# EAGLE design Octal_Reactor_Core_v0 (EAGLE 8.7.1)
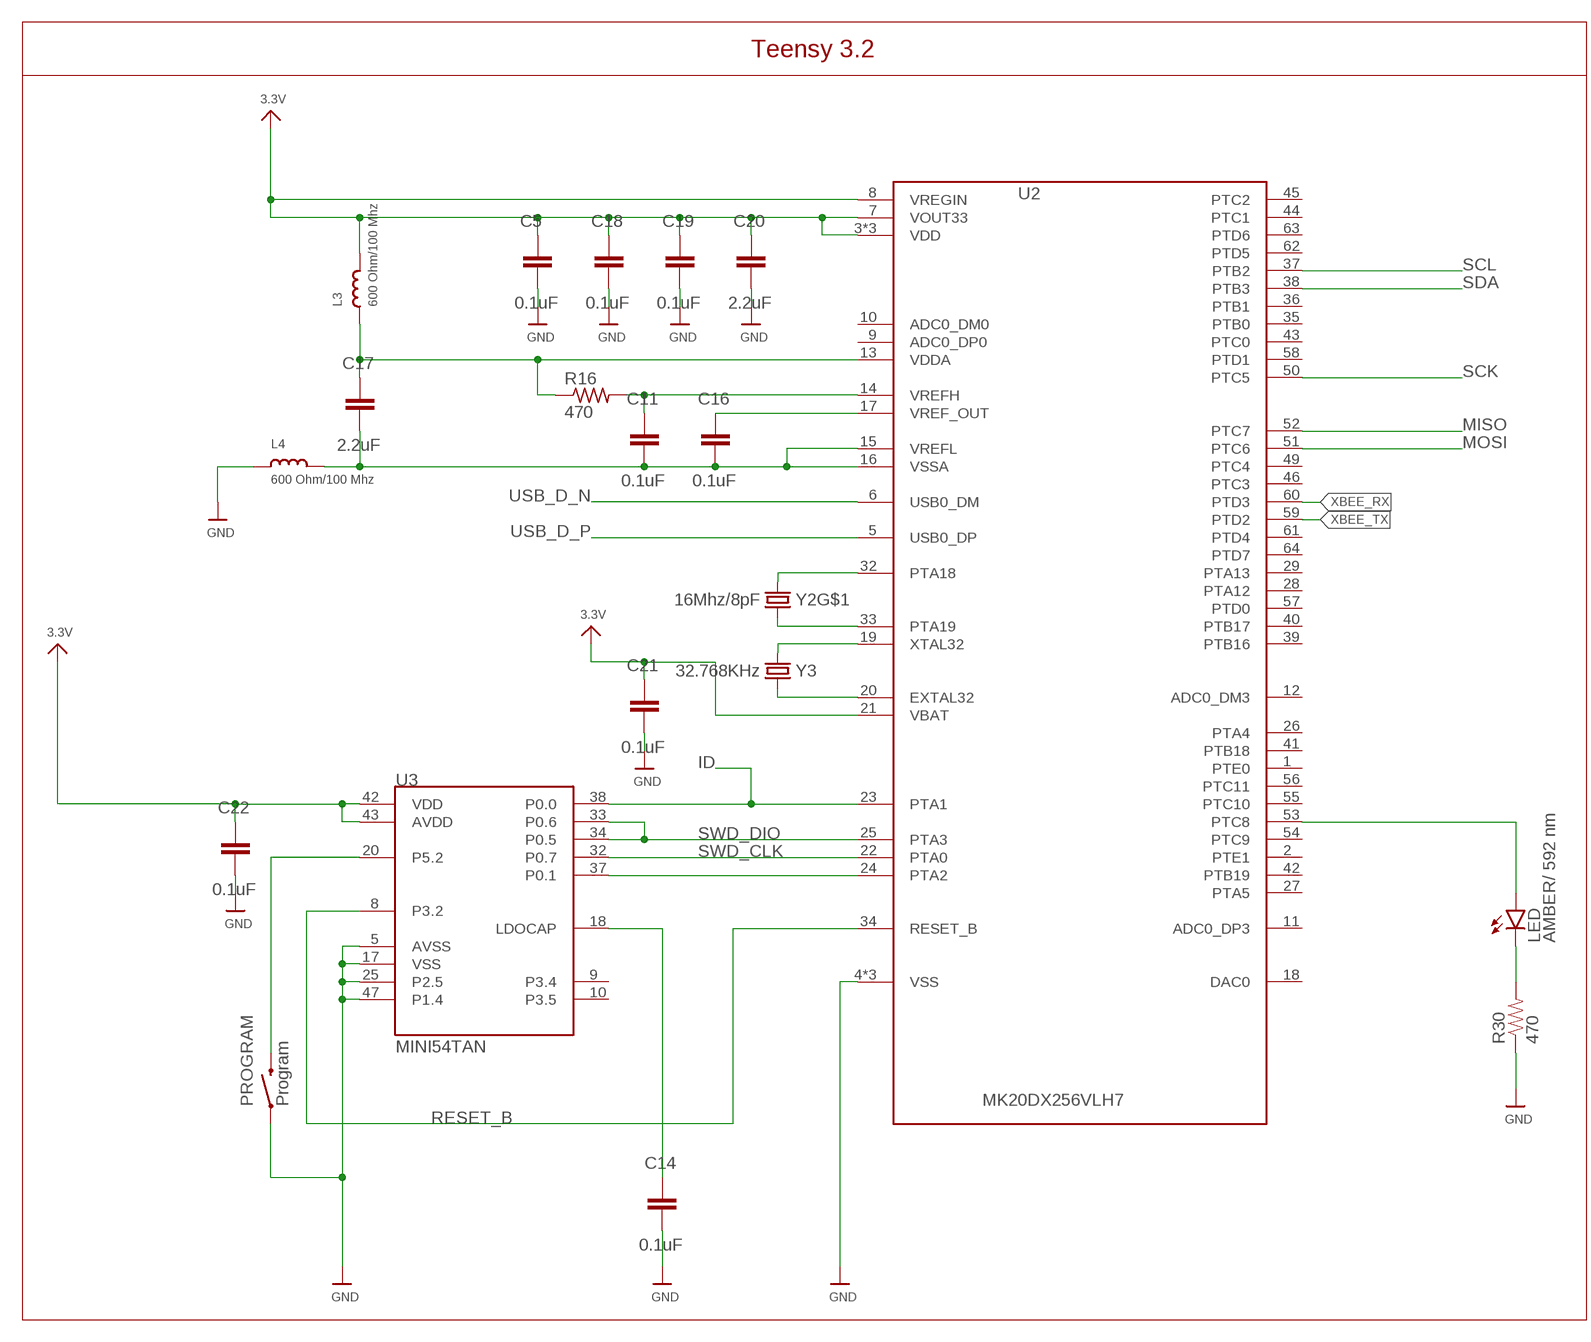
[diagram p0: schematic, sheet 1, part 1 of 2]
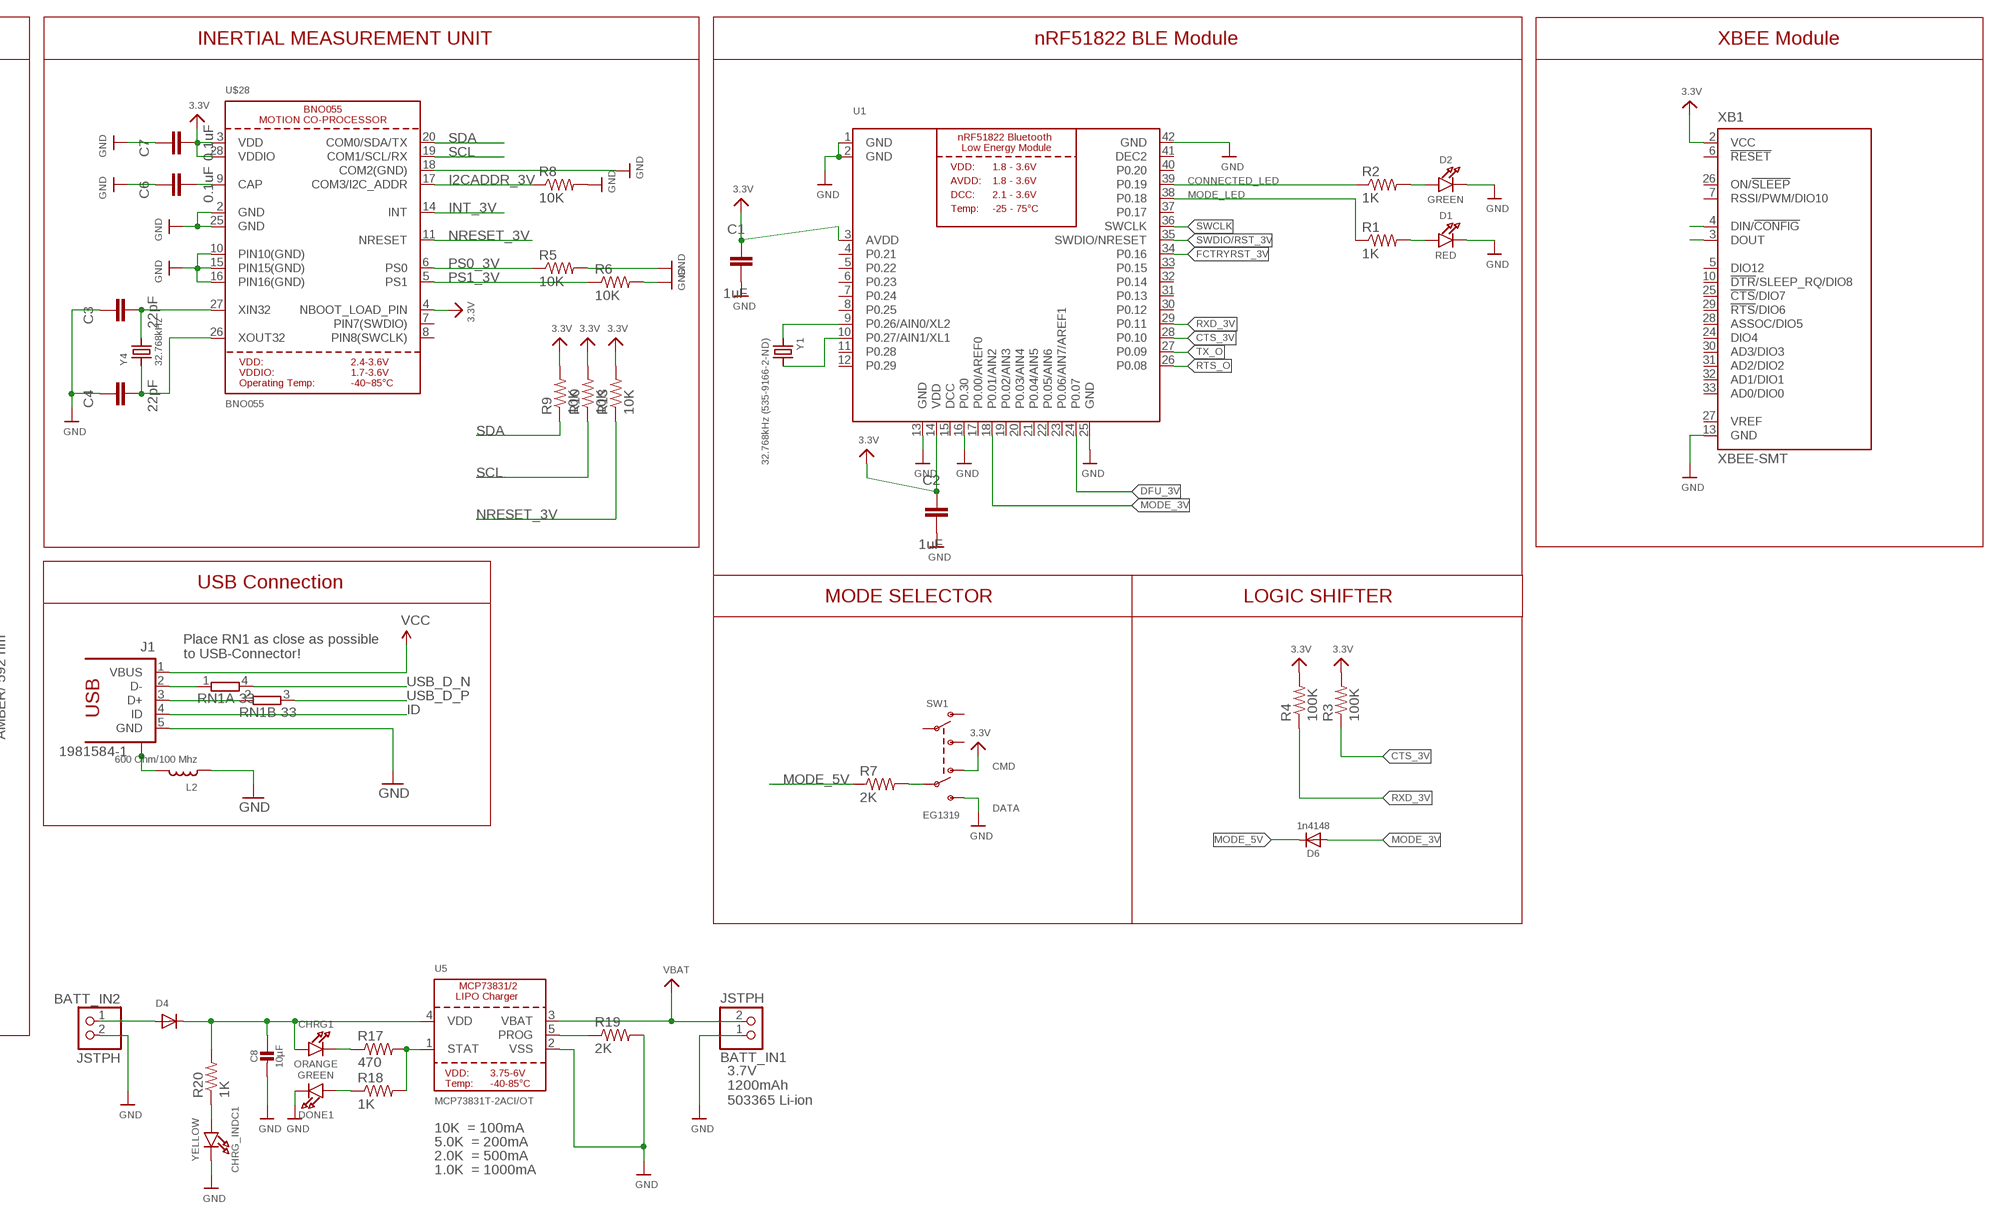
[diagram p1: schematic, sheet 1, part 2 of 2]

## Parts
BATT_IN1  JSTPH  JST_2PIN  [JSTPH2]
BATT_IN2  JSTPH  JST_2PIN  [JSTPH2]
C1  1uF  CC0402JRNPO9BN100  [CAP_0402]
C2  1uF  CC0402JRNPO9BN100  [CAP_0402]
C3  22pF  CC0402JRNPO9BN100  [CAP_0402]
C4  22pF  CC0402JRNPO9BN100  [CAP_0402]
C5  0.1uF  CC0402JRNPO9BN100  [CAP_0402]
C6  0.1uF  CC0402JRNPO9BN100  [CAP_0402]
C7  0.1uF  CC0402JRNPO9BN100  [CAP_0402]
C8  10µF  CAP_CERAMIC0805-NOOUTLINE  [0805-NO]
C11  0.1uF  CC0402JRNPO9BN100  [CAP_0402]
C14  0.1uF  CC0402JRNPO9BN100  [CAP_0402]
C16  0.1uF  CC0402JRNPO9BN100  [CAP_0402]
C17  2.2uF  CC0402JRNPO9BN100  [CAP_0402]
C18  0.1uF  CC0402JRNPO9BN100  [CAP_0402]
C19  0.1uF  CC0402JRNPO9BN100  [CAP_0402]
C20  2.2uF  CC0402JRNPO9BN220  [CAP_0402]
C21  0.1uF  CC0402JRNPO9BN100  [CAP_0402]
C22  0.1uF  CC0402JRNPO9BN100  [CAP_0402]
CHRG1  ORANGE  LED0805_NOOUTLINE  [CHIPLED_0805_NOOUTLINE]
CHRG_INDC1  YELLOW  LED0805_NOOUTLINE  [CHIPLED_0805_NOOUTLINE]
D1  RED  LED0805_NOOUTLINE  [CHIPLED_0805_NOOUTLINE]
D2  GREEN  LED0805_NOOUTLINE  [CHIPLED_0805_NOOUTLINE]
D4  DIODESOD-123  [SOD-123]
D6  1n4148  DIODESOD-323  [SOD-323]
DONE1  GREEN  LED0805_NOOUTLINE  [CHIPLED_0805_NOOUTLINE]
J1  1981584-1  [1981584-1]
L2  600 Ohm/100 Mhz  INDUCTOR-BK2125HM601-T  [0805]
L3  600 Ohm/100 Mhz  INDUCTOR-BK2125HM601-T  [0805]
L4  600 Ohm/100 Mhz  INDUCTOR-BK2125HM601-T  [0805]
LED  AMBER/ 592 nm  LED-AMBER  [LED-0603]
PROGRAM  Program  SWITCH-MOMENTARY-2-SMD-1101NE  [TACTILE-SWITCH-1101NE]
R1  1K  RC0402JR-070RL  [RES_0402]
R2  1K  RC0402JR-070RL  [RES_0402]
R3  100K  RC0402JR-070RL  [RES_0402]
R4  100K  RC0402JR-070RL  [RES_0402]
R5  10K  RC0402JR-070RL  [RES_0402]
R6  10K  RC0402JR-070RL  [RES_0402]
R7  2K  RC0402JR-070RL  [RES_0402]
R8  10K  RC0402JR-070RL  [RES_0402]
R9  10K  RC0402JR-070RL  [RES_0402]
R10  10K  RC0402JR-070RL  [RES_0402]
R13  10K  RC0402JR-070RL  [RES_0402]
R16  470  RC0402JR-070RL  [RES_0402]
R17  470  RC0402JR-070RL  [RES_0402]
R18  1K  RC0402JR-070RL  [RES_0402]
R19  2K  RC0402JR-070RL  [RES_0402]
R20  1K  RC0402JR-070RL  [RES_0402]
R30  470  RESISTOR-470  [0603-RES]
RN1  33  2R-NEXB34V  [EXB34V]
SW1  EG1319  SWITCH_DPDTEG1390  [EG1390]
U1  NRF51822_MODULE_MDBT40  [BLE_MODULE_RAYTAC_MDBT40]
U2  MK20DX256VLH7  [MK20DX256VLH7]
U3  MINI54TAN  [MINI54TAN]
U5  MCP73831T-2ACI/OT  MCP73831/2  [SOT23-5]
U$28  BNO055  [BNO055]
XB1  XBEE-SMT  [XBEE-SMT]
Y1  32.768kHz (535-9166-2-ND)  CRYSTAL2.0X6.0_32.768  [CRYSTAL_CYL_2X6MM_SMT]
Y2  16Mhz/8pF  CRYSTAL/SMD-5X3-GND16MHZ/8PF  [CRYSTAL-SMD-5X3]
Y3  32.768KHz  CRYSTAL/32.768KHZ/SMD-TXC_7A  [CRYSTAL-TXC-7A]
Y4  32.768kHz  CRYSTAL8.0X3.8  [CRYSTAL_8X3.8]

## Nets
3.3V: C1.1 C2.1 C5.1 C7.2 C18.1 C19.1 C20.1 C21.1 C22.1 L3.2 R3.2 R4.2 R9.2 R10.2 R13.2 SW1.O2 U1.3(AVDD) U1.14(VDD) U2.3(VDD) U2.7(VOUT33) U2.8(VREGIN) U2.21(VBAT) U2.30(VDD) U2.48(VDD) U3.42(VDD) U3.43(AVDD) U$28.3(VDD) U$28.4(NBOOT_LOAD_PIN) U$28.28(VDDIO) XB1.2(VCC)
CONNECTED_LED: R2.1 U1.39(P0.19)
CTS_3V: R3.1 U1.28(P0.10)
DFU_3V: U1.24(P0.07)
FCTRYRST_3V: U1.34(P0.16)
GND: BATT_IN1.1 BATT_IN2.2 C1.2 C2.2 C3.1 C4.1 C5.2 C6.1 C7.1 C8.2 C14.2 C18.2 C19.2 C20.2 C21.2 C22.2 CHRG_INDC1.C D1.C D2.C DONE1.C J1.5(GND) L2.1 L4.1 PROGRAM.P$1 R5.2 R6.2 R8.2 R19.2 R30.1 SW1.S2 U1.1(GND) U1.2(GND) U1.13(GND) U1.16(P0.30) U1.25(GND) U1.42(GND) U2.4(VSS) U2.31(VSS) U2.47(VSS) U3.5(AVSS) U3.17(VSS) U3.25(P2.5) U3.47(P1.4) U5.2(VSS) U$28.2(GND) U$28.10(PIN10(GND)) U$28.15(PIN15(GND)) U$28.16(PIN16(GND)) U$28.18(COM2(GND)) U$28.25(GND) XB1.13(GND)
I2CADDR_3V: R8.1 U$28.17(COM3/I2C_ADDR)
ID: J1.4(ID) U2.23(PTA1) U3.38(P0.0)
INT_3V: U$28.14(INT)
MISO: U2.52(PTC7)
MODE_3V: D6.A U1.18(P0.01/AIN2)
MODE_5V: D6.C R7.1
MODE_LED: R1.1 U1.38(P0.18)
MOSI: U2.51(PTC6)
N$1: U1.9(P0.26/AIN0/XL2) Y1.1
N$2: U1.10(P0.27/AIN1/XL1) Y1.2
N$3: C3.2 U$28.27(XIN32) Y4.P$4
N$4: R7.2 SW1.P2
N$5: D1.A R1.2
N$6: D2.A R2.2
N$7: XB1.4(DIN/!CONFIG)
N$8: XB1.3(DOUT)
N$9: C4.2 U$28.26(XOUT32) Y4.P$1
N$10: C6.2 U$28.9(CAP)
N$12: LED.A U2.53(PTC8)
N$15: U2.24(PTA2) U3.37(P0.1)
N$16: CHRG1.C R17.1
N$18: LED.C R30.2
N$19: PROGRAM.P$2 U3.20(P5.2)
N$22: C14.1 U3.18(LDOCAP)
N$25: R17.2 R18.2 U5.1(STAT)
N$26: R19.1 U5.5(PROG)
N$27: U2.32(PTA18) Y2.3
N$28: U2.33(PTA19) Y2.1
N$29: U2.19(XTAL32) Y3.P$2
N$30: U2.20(EXTAL32) Y3.P$1
N$31: DONE1.A R18.1
N$33: C8.1 CHRG1.A D4.C R20.2 U5.4(VDD)
N$35: CHRG_INDC1.A R20.1
NRESET_3V: R13.1 U$28.11(NRESET)
PS0_3V: R5.1 U$28.6(PS0)
PS1_3V: R6.1 U$28.5(PS1)
RESET_B: U2.34(RESET_B) U3.8(P3.2)
RTS_O: U1.26(P0.08)
RXD_3V: R4.1 U1.29(P0.11)
SCK: U2.50(PTC5)
SCL: R10.1 U2.37(PTB2) U$28.19(COM1/SCL/RX)
SDA: R9.1 U2.38(PTB3) U$28.20(COM0/SDA/TX)
SWCLK: U1.36(SWCLK)
SWD_CLK: U2.22(PTA0) U3.32(P0.7)
SWD_DIO: U2.25(PTA3) U3.33(P0.6) U3.34(P0.5)
SWDIO/RST_3V: U1.35(SWDIO/NRESET)
TX_O: U1.27(P0.09)
USB_CON_N [USB]: J1.2(D-) RN1.1
USB_CON_P [USB]: J1.3(D+) RN1.2
USB_D_N [USB]: RN1.4 U2.6(USB0_DM)
USB_D_P [USB]: RN1.3 U2.5(USB0_DP)
USB_SHIELD: J1.S1 J1.S2 J1.S3 J1.S4 L2.2
VBAT: BATT_IN1.2 U5.3(VBAT)
VCC: J1.1(VBUS)
VDDA: C17.1 L3.1 R16.1 U2.13(VDDA)
VREF_OUT: C16.1 U2.17(VREF_OUT)
VREFH: C11.1 R16.2 U2.14(VREFH)
VREFL: C11.2 C16.2 C17.2 L4.2 U2.15(VREFL) U2.16(VSSA)
VUSB: BATT_IN2.1 D4.A
XBEE_RX: U2.60(PTD3)
XBEE_TX: U2.59(PTD2)
Unconnected: SW1.O1 SW1.P1 SW1.S1 U1.4(P0.21) U1.5(P0.22) U1.6(P0.23) U1.7(P0.24) U1.8(P0.25) U1.11(P0.28) U1.12(P0.29) U1.17(P0.00/AREF0) U1.19(P0.02/AIN3) U1.20(P0.03/AIN4) U1.21(P0.04/AIN5) U1.22(P0.05/AIN6) U1.23(P0.06/AIN7/AREF1) U1.30(P0.12) U1.31(P0.13) U1.32(P0.14) U1.33(P0.15) U1.37(P0.17) U1.40(P0.20) U2.1(PTE0) U2.2(PTE1) U2.9(ADC0_DP0) U2.10(ADC0_DM0) U2.11(ADC0_DP3) U2.12(ADC0_DM3) U2.18(DAC0) U2.26(PTA4) U2.27(PTA5) U2.28(PTA12) U2.29(PTA13) U2.35(PTB0) U2.36(PTB1) U2.39(PTB16) U2.40(PTB17) U2.41(PTB18) U2.42(PTB19) U2.43(PTC0) U2.44(PTC1) U2.45(PTC2) U2.46(PTC3) U2.49(PTC4) U2.54(PTC9) U2.55(PTC10) U2.56(PTC11) U2.57(PTD0) U2.58(PTD1) U2.61(PTD4) U2.62(PTD5) U2.63(PTD6) U2.64(PTD7) U3.9(P3.4) U3.10(P3.5) U$28.7(PIN7(SWDIO)) U$28.8(PIN8(SWCLK)) XB1.5(DIO12) XB1.6(!RESET) XB1.7(RSSI/PWM/DIO10) XB1.10(!DTR!/SLEEP_RQ/DIO8) XB1.24(DIO4) XB1.25(!CTS!/DIO7) XB1.26(ON/!SLEEP) XB1.27(VREF) XB1.28(ASSOC/DIO5) XB1.29(!RTS!/DIO6) XB1.30(AD3/DIO3) XB1.31(AD2/DIO2) XB1.32(AD1/DIO1) XB1.33(AD0/DIO0) Y2.2(GND:GND) Y2.4(GND:GND)

## Notes on the sheet
- Teensy 3.2 | INERTIAL MEASUREMENT UNIT | nRF51822 BLE Module | XBEE Module
- USB Connection
- MODE SELECTOR | LOGIC SHIFTER
- Place RN1 as close as possible
  to USB-Connector!
- CMD
- DATA
- 3.7V
  1200mAh
  503365 Li-ion
- 10K  = 100mA
- 5.0K  = 200mA
- 2.0K  = 500mA
- 1.0K  = 1000mA

## Power pins joined to a net without a drawn wire
DCC: U1.15(DCC)
DEC2: U1.41(DEC2)

## Library data of the parts
BATT_IN1 BATT_IN2 = microbuilder:JST_2PIN: JST 2-Pin Right-Angle Connector PH-Series - 4UConnector: 17311 SH-Series - 4UConnector: 07278
C1-C7 C11 C14 C16-C19 C21 C22 = Resistor_Capacitor:CC0402JRNPO9BN100: CAP CER 10PF 50V C0G/NPO 0402 Manufacturer's datasheet <http://www.yageo.com/documents/recent/UPY-GP_NP0_16V-to-50V_16.pdf>; CREATED_BY: PCBLayout.com; DIGIKEY_PART_NUMBER: 311-1014-2-ND; MANUFACTURER: Yageo; MPN: CC0402JRNPO9BN100; PACKAGE: SMD 0402
C8 = microbuilder:CAP_CERAMIC: Ceramic Capacitors For new designs, use the packages preceded by an '_' character since they are more reliable: The following footprints should be used on most boards: _0402 - Standard footprint for regular board layouts _0603 - Standard footprint for regular board layouts _0805 - Standard footprint for regular board layouts _1206 - Standard footprint for regular board layouts For extremely tight-pitch boards where space is at a premium, the following 'micro-pitch' footprints can be used (smaller pads, no silkscreen outline, etc.): _0402MP - Micro-pitch footprint for very dense/compact boards _0603MP - Micro-pitch footprint for very dense/compact boards _0805MP - Micro-pitch footprint for very dense/compact boards _1206MP - Micro-pitch footprint for very dense/compact boards
C20 = Resistor_Capacitor:CC0402JRNPO9BN220: CAP CER 22PF 50V C0G/NPO 0402 Manufacturer's datasheet <http://www.yageo.com/documents/recent/UPY-GP_NP0_16V-to-50V_16.pdf>; CREATED_BY: PCBLayout.com; DIGIKEY_PART_NUMBER: 311-1018-2-ND; MANUFACTURER: Yageo; MPN: CC0402JRNPO9BN220; PACKAGE: SMD 0402
CHRG1 CHRG_INDC1 D1 D2 DONE1 = microbuilder:LED: LED 0603 - 0603 Surface Mount Package 2mA: Green LED - Low Power (3.9mcd, 2ma, 1.7Vf) - Digikey: 475-2709-2-ND Orange LED - Low Power (9.8mcd, 2ma, 1.8Vf) - Digikey: 475-1194-2-ND Red LED - Low Power (5mcd, 2ma, 1.8Vf) - Digikey: 475-1195-2-ND Yellow LED - Low Power (7mcd, 2ma, 1.8Vf) - Digikey: 475-1196-2-ND 5mA: Blue LED - Low Power (17mcd, 5ma, 2.9Vf) - Digikey: LNJ937W8CRACT-ND 0805 - 0805 Surface Mount Package 2mA: Red LED (8.8mcd, 2mA, 1.8Vf, Clear) - Low Power [Digikey: 475-2510-1-ND] Green LED (5mcd, 2mA, 1.8Vf, Clear) - Low Power [Digikey: 475-2730-1-ND] Yellow LED (11.3mcd, 2mA, 1.8Vf, Clear) - Low Power [Digikey: 475-2555-1-ND] 20mA: Red LED (104mcd, 20mA, Diffused) - LS R976 [Digikey: 475-1278-6-ND] Red LED (12mcd, 20mA, 2.0Vf, Clear) - APT2012EC [Digikey: 754-1128-1-ND] Green LED (15mcd, 20mA, 2.2Vf, Clear) - APT2012GC [Digikey: 754-1131-1-ND] Orange LED (160mcd, 20mA, 2.1Vf, Clear) - APT2012SECK [Digikey: 754-1130-1-ND] 1206 - 1206 Surface Mount Package Green LED (26mcd, 20mA, Diffused) - LG N971 [Digikey: 475-1407-6-ND] Red LED (15mcd, 20mA, Diffused) - LH N974 [Digikey: 475-1416-6-ND] Cree - Cree High-Power Surface Mount LEDs XPEBWT-L1-0000-00D50 - White 111lm 350mA 2.9Vf 6200K 110° XTEAWT-00-0000-00000LEE3 - White 114lm 350mA 2.85Vf 5000K 115° Everlight - Everlight 45-21 Series Surface Mount LEDs 45-21/QK2C-B2832AC2CB2/2T - Warm White 2000mcd 20mA 3.25Vf 3050K 120° 45-21/LK2C-B38452C4CB2/2T - Nuetral White 2000mcd 20mA 3.25Vf 4150K 120° 45-21/LK2C-B50634C6CB2/2T - Cold White 2200mcd 20mA 3.25Vf 5650K 120° PLCC2 Reverse Mount LS T77K-J1L2-1-0-2-R18-Z - Red 11.25mcd 2mA 1.8Vf 630nm 120° LO T77K-L1M2-24-Z - Orange 19.6mcd 2mA 1.8Vf 606nm 120° LY T77K-K2M1-26-Z - Yellow 15.7mcd 2mA 1.8Vf 587nm 120°
D4 = adafruit:DIODE: Diode
D6 = microbuilder:DIODE: Diode
J1 = con-usb:1981584-1: Receptacle, micro-USB, type A/B Tyco Electronics; MF: Hirose; MPN: ZX62-AB-5PA(11)
L2-L4 = appfruits:INDUCTOR: Inductors 0603: 10nH Ceramic Inductor - microwire antenna/RF (Digikey: 712-1434-2-ND) 0805: 560nH Ceramic Inductor - RF (Digikey: 553-1047-1-ND) 270nH Ceramic Inductor - Q = 40@250MHz, +-5%, 1 Ohm DC Resistance (Digikey: 535-10506-2-ND) 1007 (2518 Metric) SMT: 10µH 10% 250mOhm 820mA 1007 Inductor (Digikey: 587-2189-1-ND) 22µH 10% 500mOhm 580mA 1007 Inductor (Digikey: 587-2190-1-ND) 47µH 10% 950mOhm 420mA 1007 Inductor (Digikey: 587-2191-1-ND) 47µH 5% 100mOhm 1A 1008 Inductor (Digikey: 732-1816-1-ND) 5.0x5.0mm (Taiyo Yuden NR5040 Series) 6.8µH 20% 2.3A 64mOhm Inductor (Digikey: 587-2374-2-ND) 5.0x5.0mm (TDK VLC5045 Series) 4.7µH 20% 3.3A 34mOhm Inductor (Digikey: 445-6526-1-ND) 6.8µH 20% 2.7A 46mOhm Inductor (Digikey: 445-6527-1-ND) 6.0x6.0mm (TDK VLC6045 Series) 4.7µH 20% 3.8A 27mOhm Inductor (Digikey: 445-6538-2-ND) 6.8µH 20% 3A 41mOhm Inductor (Digikey: 445-6540-1-ND) 6.2µH 30% 2.2A 45mOhm Inductor (Digikey: SRR5028-6R2YCT-ND) - Not TDK VLC6045 but footprint should match 6.0x6.0mm (TDK SLF6045 Series) 6.8uH 30% 2A 33mOhm Inductor (Digikey: 445-4572-1-ND, Mouser: 810-SLF645T6R8N2R0PF) 6.0x6.0mm (Sumida CDRH5D28 Series) 6.2uH 30% 1.8A 45mOhm Inductor (Digikey: 308-1542-1-ND) Taiyo Yuden NR3015T2R2M - 2.2uH 20% 1.5A (Digikey: 587-1648-2-ND, Mouser: 963-NR3015T2R2M) - Used with TI TPS62172 CoilCraft RFID Transponder Coil - MA5532-AE (For use with AS3935 Lightning Sensor); MF: Taiyo Yuden; MPN: BK2125HM601-T
LED = appfruits:LED: LEDs Standard schematic elements and footprints for 5mm, 3mm, 1206, and 0603 sized LEDs. 5mm - Spark Fun Electronics SKU : COM-00529 (and others); MF: Avago Technologies; MPN: HSMA-C190
PROGRAM = SparkFun-Electromechanical:SWITCH-MOMENTARY-2: Various NO switches- pushbuttons, reed, etc; MF: C&K Components; MPN: RS-282G05A3-SM RT
R1-R10 R13 R16-R20 = Resistor_Capacitor:RC0402JR-070RL: RES SMD 0 OHM JUMPER 1/16W 0402 Manufacturer's datasheet <http://www.yageo.com/documents/recent/PYu-RC_Group_51_RoHS_L_10.pdf>; CREATED_BY: PCBLayout.com; DIGIKEY_PART_NUMBER: 311-0.0JRTR-ND; MANUFACTURER: Yageo; MPN: RC0402JR-070RL; PACKAGE: SMD 0402
R30 = appfruits:RESISTOR: Resistor Basic schematic elements and footprints for 0603, 1206, and PTH resistors.; MF: Panasonic; MPN: ERJ-3GEYJ471V
RN1 = resistor-dil:2R-N: Array Chip Resistor Source: Panasonic; MF: Panasonic; MPN: EXB-34V330JV; OC_FARNELL: unknown; OC_NEWARK: unknown
SW1 = microbuilder:SWITCH_DPDT: Switch - DPDT A DPDT Switch acts like an SPDT switch, but has a pair of switches instead of just one. Vertical - 0.3A @ 6V SMT - Digikey: JS202011SCQN
U1 = microbuilder:NRF51822_MODULE_MDBT40: nRF51822 Bluetooth Low Energy Module
U2 = appfruits:MK20DX256VLH7; MF: Freescale; MPN: MK20DX256VLH7
U3 = TeensyCustom:MINI54TAN: MINI54TAN Bootloader from PJRC.com, preprogrammed with Teensy 3.0 bootloader. https://www.pjrc.com/store/ic_mini54_tqfp.html
U5 = microbuilder:MCP73831/2: MCP73831/2 LIPO Charger VDD: 3.75 - 6V Temp -40 - 85°C Programmable Charge Rate: 15-500mA NOTE: STAT is a tri-state logic output on the MCP73831 and an open-drain output on the MCP73832. SOT23-5 with 4.2V output and tri-state logic on STAT = MCP73831T-2ACI/OT
U$28 = microbuilder:BNO055: BNO055 - Motion Co-Processor
XB1 = xbee:XBEE-SMT: XBee(TM)/XBee-PRO(TM) ZB SMT RF Modules. Source: Digi (90002002_a.pdf) (http://www.digi.com/products/wireless-wired-embedded-solutions/zigbee-rf-modules/zigbee-mesh-module/xbee-smt.jsp#overview)
Y1 Y4 = microbuilder:CRYSTAL: Crystals HC49UP - Surface Mount Crystal 4.0MHz 18pF +/-30ppm Surface Mount Crystal [Digikey: 535-9857-1-ND] 12.0 MHz Surface Mount Crystal [Digikey: 535-9869-6-ND] 25.0 MHz Surface Mount Crystal [Digikey: 535-9078-1-ND] 2.5 x 2.0mm - MEMs SMT Crystal 16.0 MHz 10pF 20ppm 2.5 x 2.0mm Crystal [Digikey -40-85°C: 535-10923-1-ND] 3.2 x 2.5mm - MEMs SMT Crystal 12.0 MHz 8pF 15ppm 3.2 x 2.5mm Crystal [Digikey: -10-70°C: 644-1047-1-ND -40-125°C: 644-1128-1-ND] 40~85°C cheaper: 644-1173-6-ND 16.0 MHz 8pF 15ppm 3.2 x 2.5mm Crystal [Digikey: -10-70°C: 644-1049-1-ND -40-125°C: 644-1129-2-ND]-40~85°C cheaper: 644-1175-6-ND 16.0 MHz 10pF 10ppm 3.2 x 2.5mm Crystal [Digikey: 644-1100-1-ND] 27.12 MHz 18pF 30ppm 3.2 x 2.5mm Crystal [Digikey: 887-1424-1-ND] 27.12MHz 10pF 10ppm 3.2 x 2.5mm Crystal [Digikey: 887-1329-1-ND] 4.9 x 1.8mm - MEMs SMT Crystal 32.768 KHz 12.5pF 20ppm 4.9 x 1.8mm Crystal [Digikey: SE2415CT-ND] 8.0 x 3.8mm - Surface Mount Crystal 32.768kHz 12.5pF 20ppm -40°C-85°C [Digikey: 535-9166-2-ND] Cylinder 32.768KHz Cylinder Crystal (2x6mm body) [Ex. Digikey: 300-8341-2-ND]
Y2 = appfruits:CRYSTAL/SMD-5X3-GND; MF: ECS; MPN: ECS-160-8-30B-CKM
Y3 = appfruits:CRYSTAL/32.768KHZ/SMD-TXC_7A; MF: Epson Timing; MPN: FC-255 32.7680K-A3

## Net classes
1 USB: width 0.254 mm, drill 0.33 mm, clearance 0.159 mm
2 Top GND Pour: clearance 0.762 mm to class 1

## Board
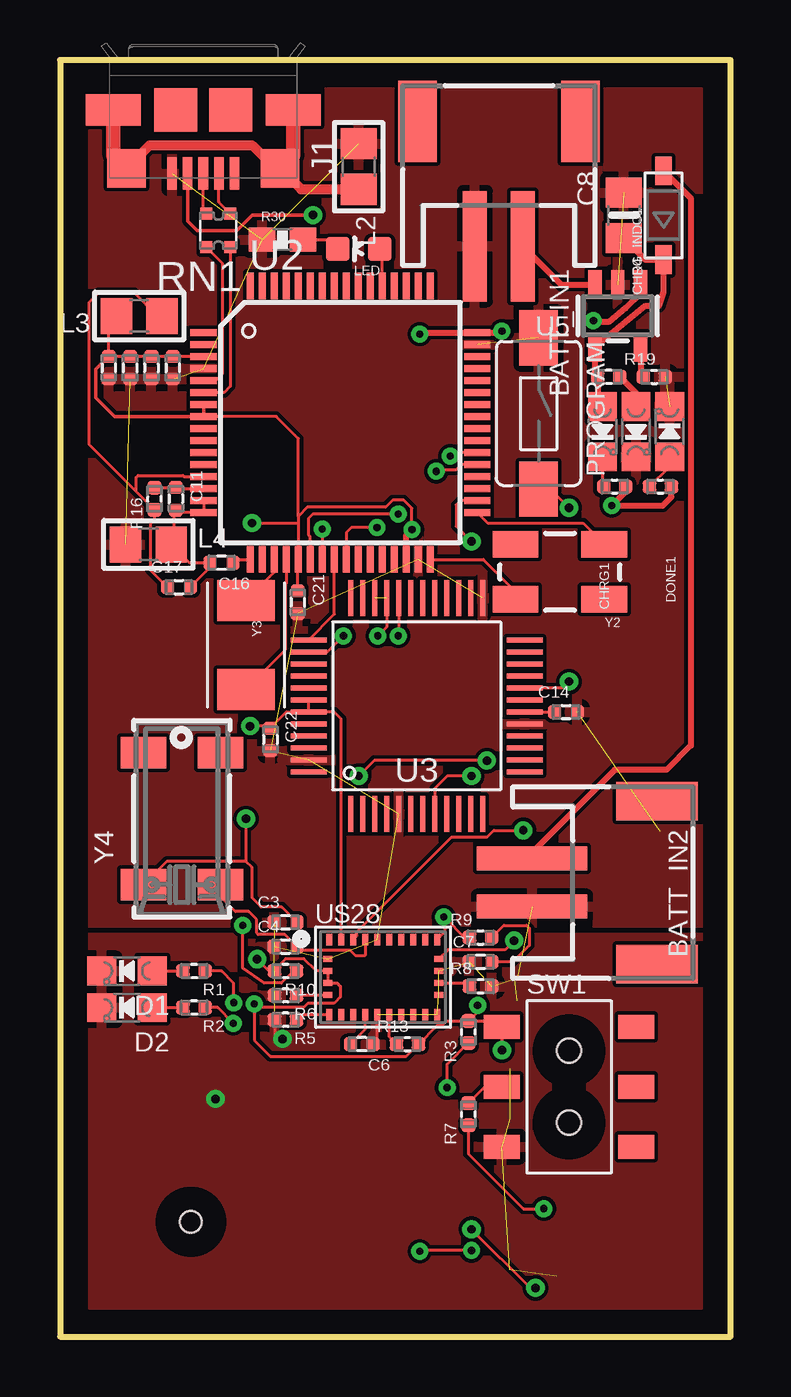
[diagram p2: board, top side]
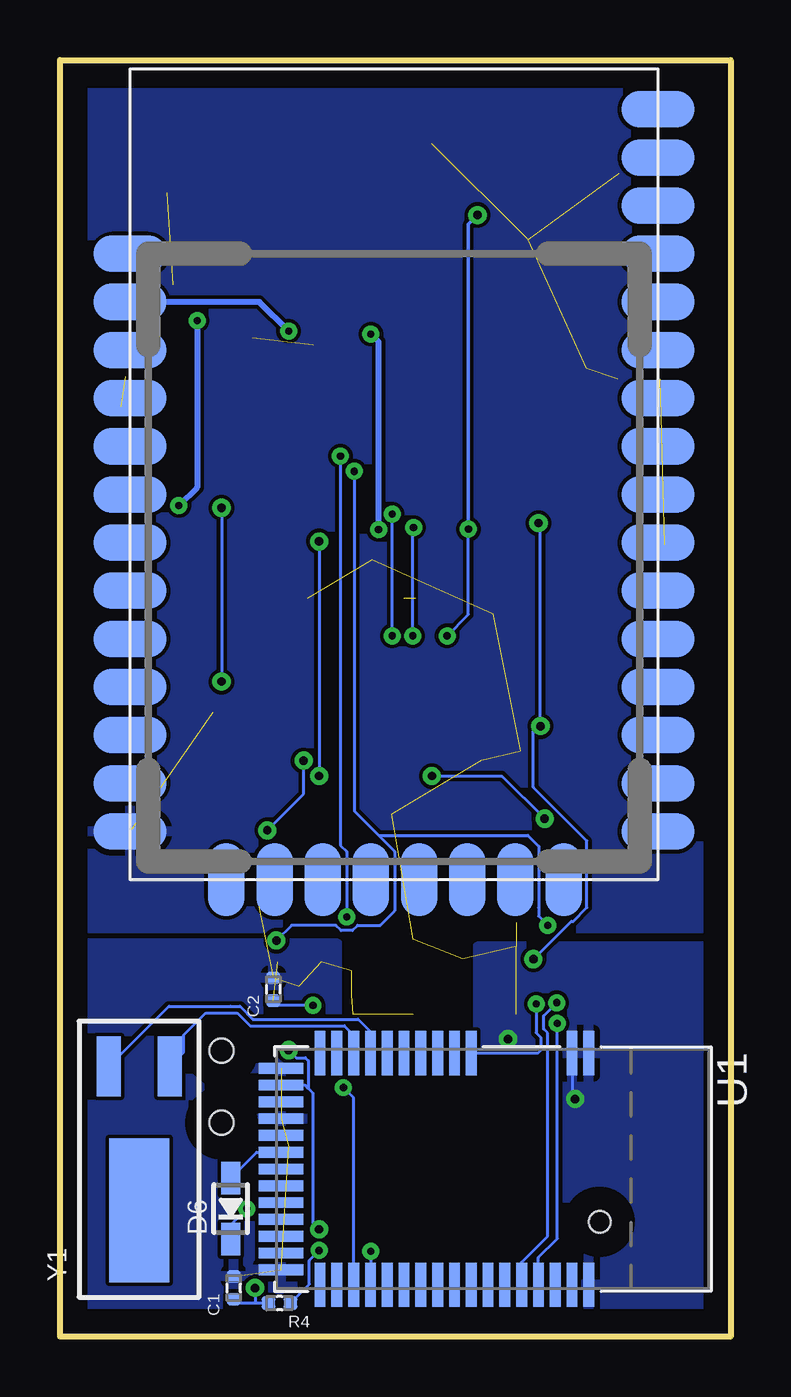
[diagram p3: board, bottom side, seen from below]

Size 27.94 x 53.21 mm. Coordinates in mm from the lower left corner, seen from the top.
Outline: 0,53.21 0,0 27.94,0 27.94,53.21 0,53.21
Copper layers (1*16): Top 0.035mm / dielectric 1.5mm / Bottom 0.035mm
Design rules "default": minimum track width 6mil, minimum drill 0.35mm, track to track 6mil, track to pad 6mil, pad to pad 6mil, via to via 6mil, smd to smd 6mil, copper to edge 40mil, drill to drill 6mil, minimum pad ring 10mil, minimum via ring 8mil, stop-mask expansion 4mil, vias tented up to drill 0mil, thermal gap 10mil

### Footprints (pad centres in the part's own frame; a part is rotated, then mirrored left to right if it is on the bottom)
JSTPH2 = smd 1 x 4.6: 1 -1,-3.7; 2 1,-3.7 | smd 1.6 x 3.4: NC1 -3.4,1.5; NC2 3.4,1.5
CAP_0402 = smd 0.55 x 0.58: 1 -0.475,0; 2 0.475,0
0805-NO = smd 1.24 x 1.5: 1 -0.95,0; 2 0.95,0
CHIPLED_0805_NOOUTLINE = smd 1.2 x 1.2: A 0,-1.05; C 0,1.05
SOD-123 = smd 1.2 x 0.7: A 1.85,0; C -1.85,0
SOD-323 = smd 1.35 x 0.8: A 1.27,0; C -1.27,0
1981584-1 = smd 0.4 x 1.35: 1 -1.3,4.1; 2 -0.65,4.1; 3 0,4.1; 4 0.65,4.1; 5 1.3,4.1 | smd 1.8 x 1.8: M1 -1.15,1.45; M2 1.15,1.45 | smd 2.3 x 1.3: S1 -3.75,1.45; S2 3.75,1.45 | smd 1.6 x 1.6: S3 -3.2,3.885; S4 3.2,3.885
0805 = smd 1.3 x 1.5: 1 -0.95,0; 2 0.95,0
LED-0603 = smd 1 x 1: A 0,-0.877; C 0,0.877
TACTILE-SWITCH-1101NE = smd 2.3 x 1.6: P$1 -3.15,0; P$2 3.15,0
RES_0402 = smd 0.58 x 0.58: 1 -0.46,0; 2 0.46,0
0603-RES = smd 1.1 x 1: 1 -0.85,0; 2 0.85,0
EXB34V = smd 0.5 x 0.5: 1 -0.5,-0.7; 2 0.5,-0.7; 3 0.5,0.7; 4 -0.5,0.7
EG1390 = smd 1 x 1.5: O1 -2.5,2.8; O2 -2.5,-2.8; P1 0,2.8; P2 0,-2.8; S1 2.5,2.8; S2 2.5,-2.8 | hole 1: 1.5,0; -1.5,0
BLE_MODULE_RAYTAC_MDBT40 = smd 1.85 x 0.45: 1 -4.825,4; 2 -4.825,3.3; 3 -4.825,-0.9; 4 -4.825,-1.6; 5 -4.825,-2.3; 6 -4.825,-3; 7 -4.825,-3.7; 8 -4.825,-4.4; 9 -4.825,-5.1; 10 -4.825,-5.8; 11 -4.825,-6.5; 12 -4.825,-7.2; 26 4.825,-7.2; 27 4.825,-6.5; 28 4.825,-5.8; 29 4.825,-5.1; 30 4.825,-4.4; 31 4.825,-3.7; 32 4.825,-3; 33 4.825,-2.3; 34 4.825,-1.6; 35 4.825,-0.9; 36 4.825,-0.2; 37 4.825,0.5; 38 4.825,1.2; 39 4.825,1.9; 40 4.825,2.6; 41 4.825,3.3; 42 4.825,4 | smd 0.45 x 1.85: 13 -4.2,-8.825; 14 -3.5,-8.825; 15 -2.8,-8.825; 16 -2.1,-8.825; 17 -1.4,-8.825; 18 -0.7,-8.825; 19 0,-8.825; 20 0.7,-8.825; 21 1.4,-8.825; 22 2.1,-8.825; 23 2.8,-8.825; 24 3.5,-8.825; 25 4.2,-8.825 | hole 0.9: 2.2,4.45
MK20DX256VLH7 = smd 1.1 x 0.285: 1 -5.7,3.75; 2 -5.7,3.25; 3 -5.7,2.75; 4 -5.7,2.25; 5 -5.7,1.75; 6 -5.7,1.25; 7 -5.7,0.75; 8 -5.7,0.25; 9 -5.7,-0.25; 10 -5.7,-0.75; 11 -5.7,-1.25; 12 -5.7,-1.75; 13 -5.7,-2.25; 14 -5.7,-2.75; 15 -5.7,-3.25; 16 -5.7,-3.75; 33 5.7,-3.75; 34 5.7,-3.25; 35 5.7,-2.75; 36 5.7,-2.25; 37 5.7,-1.75; 38 5.7,-1.25; 39 5.7,-0.75; 40 5.7,-0.25; 41 5.7,0.25; 42 5.7,0.75; 43 5.7,1.25; 44 5.7,1.75; 45 5.7,2.25; 46 5.7,2.75; 47 5.7,3.25; 48 5.7,3.75 | smd 0.285 x 1.1: 17 -3.75,-5.7; 18 -3.25,-5.7; 19 -2.75,-5.7; 20 -2.25,-5.7; 21 -1.75,-5.7; 22 -1.25,-5.7; 23 -0.75,-5.7; 24 -0.25,-5.7; 25 0.25,-5.7; 26 0.75,-5.7; 27 1.25,-5.7; 28 1.75,-5.7; 29 2.25,-5.7; 30 2.75,-5.7; 31 3.25,-5.7; 32 3.75,-5.7; 49 3.75,5.7; 50 3.25,5.7; 51 2.75,5.7; 52 2.25,5.7; 53 1.75,5.7; 54 1.25,5.7; 55 0.75,5.7; 56 0.25,5.7; 57 -0.25,5.7; 58 -0.75,5.7; 59 -1.25,5.7; 60 -1.75,5.7; 61 -2.25,5.7; 62 -2.75,5.7; 63 -3.25,5.7; 64 -3.75,5.7
MINI54TAN = smd 0.203 x 1.5: 1 -2.75,-4.5; 2 -2.25,-4.5; 3 -1.75,-4.5; 4 -1.25,-4.5; 5 -0.75,-4.5; 6 -0.25,-4.5; 7 0.25,-4.5; 8 0.75,-4.5; 9 1.25,-4.5; 10 1.75,-4.5; 11 2.25,-4.5; 12 2.75,-4.5; 25 2.75,4.5; 26 2.25,4.5; 27 1.75,4.5; 28 1.25,4.5; 29 0.75,4.5; 30 0.25,4.5; 31 -0.25,4.5; 32 -0.75,4.5; 33 -1.25,4.5; 34 -1.75,4.5; 35 -2.25,4.5; 36 -2.75,4.5 | smd 1.5 x 0.203: 13 4.5,-2.75; 14 4.5,-2.25; 15 4.5,-1.75; 16 4.5,-1.25; 17 4.5,-0.75; 18 4.5,-0.25; 19 4.5,0.25; 20 4.5,0.75; 21 4.5,1.25; 22 4.5,1.75; 23 4.5,2.25; 24 4.5,2.75; 37 -4.5,2.75; 38 -4.5,2.25; 39 -4.5,1.75; 40 -4.5,1.25; 41 -4.5,0.75; 42 -4.5,0.25; 43 -4.5,-0.25; 44 -4.5,-0.75; 45 -4.5,-1.25; 46 -4.5,-1.75; 47 -4.5,-2.25; 48 -4.5,-2.75
SOT23-5 = smd 0.55 x 1.2: 1 -0.95,-1.3; 2 0,-1.3; 3 0.95,-1.3; 4 0.95,1.3; 5 -0.95,1.3
BNO055 = smd 0.25 x 0.475: 1 -2.25,1.562; 6 -2.25,-1.562; 7 -1.75,-1.562; 8 -1.25,-1.562; 9 -0.75,-1.562; 10 -0.25,-1.562; 11 0.25,-1.562; 12 0.75,-1.562; 13 1.25,-1.562; 14 1.75,-1.562; 15 2.25,-1.562; 20 2.25,1.562; 21 1.75,1.562; 22 1.25,1.562; 23 0.75,1.562; 24 0.25,1.562; 25 -0.25,1.562; 26 -0.75,1.562; 27 -1.25,1.562; 28 -1.75,1.562 | smd 0.375 x 0.25: 2 -2.312,0.75; 3 -2.312,0.25; 4 -2.312,-0.25; 5 -2.312,-0.75; 16 2.312,-0.75; 17 2.312,-0.25; 18 2.312,0.25; 19 2.312,0.75
XBEE-SMT = smd 3.048 x 1.524: 1 0,26.086; 2 0,24.079; 3 0,22.073; 4 0,20.066; 5 0,18.059; 6 0,16.053; 7 0,14.046; 8 0,12.04; 9 0,10.033; 10 0,8.026; 11 0,6.02; 12 0,4.013; 13 0,2.007; 22 21.996,2.007; 23 21.996,4.013; 24 21.996,6.02; 25 21.996,8.026; 26 21.996,10.033; 27 21.996,12.04; 28 21.996,14.046; 29 21.996,16.053; 30 21.996,18.059; 31 21.996,20.066; 32 21.996,22.073; 33 21.996,24.079; 34 21.996,26.086; 35 21.996,28.092; 36 21.996,30.099; 37 21.996,32.106 | smd 1.524 x 3.048: 14 4.013,0; 15 6.02,0; 16 8.026,0; 17 10.033,0; 18 12.04,0; 19 14.046,0; 20 16.053,0; 21 18.059,0
CRYSTAL_CYL_2X6MM_SMT = smd 2.5 x 1: 1 2.125,1.27; 2 2.125,-1.27 | smd 6 x 2.5: CYLINDER -3.875,0
CRYSTAL-SMD-5X3 = smd 1.9 x 1.1: 1 -1.85,-1.15; 2 1.85,-1.15; 3 1.85,1.15; 4 -1.85,1.15
CRYSTAL-TXC-7A = smd 1.7 x 2.4: P$1 1.85,0; P$2 -1.85,0
CRYSTAL_8X3.8 = smd 1.3 x 1.9: P$1 -2.75,-1.6; P$2 2.75,-1.6; P$3 2.75,1.6; P$4 -2.75,1.6

### Placement (x,y rotation side)
BATT_IN1  18.29,49.15 0 top
BATT_IN2  23.37,18.92 270 top
C1  20.7,2.03 90 bottom
C2  19.05,14.48 90 bottom
C3  9.4,17.27 0 top
C4  9.4,16.26 0 top
C5  4.7,40.39 270 top
C6  12.57,12.19 180 top
C7  17.53,15.62 0 top
C8  23.5,46.74 90 top
C11  4.83,34.92 270 top
C14  21.08,26.04 0 top
C16  6.73,32.26 180 top
C17  4.95,31.24 0 top
C18  2.03,40.39 270 top
C19  2.92,40.39 270 top
C20  3.81,40.39 270 top
C21  9.91,30.61 270 top
C22  8.76,24.89 270 top
CHRG1  22.61,37.72 180 top
CHRG_INDC1  24,37.72 180 top
D1  2.79,15.24 90 top
D2  2.79,13.72 90 top
D4  25.15,46.74 90 top
D6  20.83,5.33 90 bottom
DONE1  25.4,37.72 0 top
J1  5.97,52.58 180 top
L2  12.45,48.77 270 top
L3  3.3,42.55 180 top
L4  3.68,33.02 0 top
LED  12.45,45.34 90 top
PROGRAM  19.94,38.48 270 top
R1  5.59,15.24 180 top
R2  5.59,13.72 180 top
R3  17.02,12.7 90 top
R4  18.8,1.4 180 bottom
R5  9.4,13.21 180 top
R6  9.4,14.22 180 top
R7  17.02,9.27 90 top
R8  17.53,14.61 0 top
R9  17.53,16.64 0 top
R10  9.4,15.24 180 top
R13  14.48,12.19 0 top
R16  3.94,34.92 90 top
R17  23.11,35.43 0 top
R18  25.02,35.43 0 top
R19  24.77,40 0 top
R20  22.86,40 180 top
R30  9.27,45.72 0 top
RN1  6.6,46.1 180 top
SW1  21.21,10.41 270 top
U1  9.91,6.99 270 bottom
U2  11.68,38.1 0 top
U3  14.86,26.29 0 top
U5  23.24,42.55 180 top
U$28  13.46,14.99 0 top
XB1  25.02,19.05 0 bottom
Y1  24.64,9.14 90 bottom
Y2  20.83,31.88 180 top
Y3  7.75,28.83 270 top
Y4  5.08,21.59 90 top

### Tracks (layer width: path | path; a pad name or v marks a point on that pad's centre or on a via)
3.3V  (via drill 0.3, 0.35)  (1 unrouted)
  Top 0.127: R3.2 16.12,13.16 15.93,12.97 15.72,12.97 R13.2 14.43,11.68 8.76,11.68 8.1,12.35 v8.1,13.87 8.23,13.87 8.38,13.72 10.15,13.72 10.33,13.9 11.43,13.9 11.68,14.15 11.68,14.61 11.55,14.74 U$28.4 U$28.3 10.67,15.24 10.16,15.75 9.4,15.75 8.94,15.29 R10.2 8.71,15.24 v8.21,15.73 | R3.2 18.16,13.16 SW1.O2 v18.41,11.94 | R3.2 17.4,13.54 v17.4,13.8 | U3.43 9.44,26.04 C22.1 8.68,25.45 v7.92,25.45 | U3.43 U3.42 | C21.1 9.91,32.37 U2.21 9.93,33.91 | v14.67,33.64 14.67,34.53 14.33,34.86 13.86,34.86 13.57,34.57 10.31,34.57 9.93,34.19 | 9.93,34.19 9.93,33.91 | L3.2 2.03,42.23 C18.1 C19.1 C20.1 C5.1 U2.3 | v17.14,4.47 19.59,2.03 v19.81,2.03 | 9.93,34.19 9.93,37.44 9.02,38.35 U2.8 | v8,33.91 9.93,33.91 | U$28.28 11.71,25.75 11.43,26.04 U3.43 | R9.2 18.49,17.14 19.43,17.14 19.56,17.02 19.56,16.3 18.87,15.62 C7.2
  Top 0.152: C18.1 1.5,40.33 1.5,39.14 2.29,38.35 U2.8 U2.7
  Top 0.254: U2.30 14.43,33.41 v14.67,33.64 | v14.99,41.78 15.05,41.85 U2.48 18.36,41.85 v18.41,41.91
  Bottom 0.127: R4.2 19.81,1.4 | 19.81,1.4 20.54,1.4 C1.1 | v8.1,13.87 8.1,12.67 7.9,12.47 7.9,11.94 8.03,11.81 U1.3 | v17.4,13.8 18.85,13.8 C2.1 | U1.14 17.72,10.49 17.59,10.35 | 17.59,10.35 17.4,10.16 17.4,4.73 v17.14,4.47 | v19.81,2.03 19.81,1.4 | v18.41,11.94 18.1,11.63 17.72,11.63 17.59,11.5 17.59,10.35 | v7.92,25.45 7.92,25.53 | 7.92,25.53 7.92,33.83 v8,33.91 | 7.92,25.53 8.21,25.23 8.21,22.9 5.98,20.66 5.98,17.88 6.55,17.31 6.64,17.31 v8.21,15.73
  Bottom 0.254: v14.67,33.64 14.67,41.46 v14.99,41.78 | v18.41,41.91 19.63,43.13 XB1.2
CONNECTED_LED  (via drill 0.3)
  Top 0.127: v7.22,13.06 6.57,13.72 R2.1
  Bottom 0.127: U1.39 8.01,3.3 7.22,4.08 v7.22,13.06
CTS_3V  (via drill 0.3)
  Top 0.127: v16.13,10.38 16.13,11.35 R3.1
  Bottom 0.127: U1.28 15.71,9.96 v16.13,10.38
GND  (via drill 0.35)  (31 unrouted)
  Top 0.127: C6.1 13.21,12.36 U$28.10 | v9.27,12.4 8.94,12.4 R5.2 8.94,13.44
  Bottom 0.127: U1.2 6.61,9.91 v6.48,9.91
  pour Top: -0.76,17.27 29.46,17.27 29.46,19.68 29.46,53.98 29.21,53.98 -0.76,53.98
  pour Top: -1.14,-2.03 -1.14,16.64 10.41,16.64 10.41,12.83 16.51,12.83 16.51,16.64 28.45,16.64 28.45,-2.03
  pour Bottom: -0.51,17.02 28.96,17.02 28.96,54.23 -0.64,54.23 -0.64,17.02
  pour Bottom: -0.51,16.26 10.54,16.26 10.54,12.95 16.38,12.95 16.38,16.38 28.32,16.38 28.32,-0.76 -0.51,-0.76
I2CADDR_3V
  Top 0.127: U$28.17 16.93,14.74 R8.1
ID  (via drill 0.3, 0.35)
  Top 0.127: U3.38 11.14,28.54 v11.81,29.21 | v10.92,33.66 10.92,32.41 U2.23
  Top 0.152: v10.54,46.75 8.02,46.75 7.37,46.1 5.71,46.1 5.32,46.5 J1.4
  Bottom 0.127: v11.81,29.21 10.92,30.1 v10.92,33.66
  Bottom 0.152: v10.92,33.66 10.92,46.37 v10.54,46.75
MODE_3V
  Bottom 0.127: D6.A 19.75,7.68 U1.18
MODE_5V  (via drill 0.3)
  Top 0.127: R7.1 17.02,7.62 19.3,5.33 v20.16,5.33
  Bottom 0.127: v20.16,5.33 20.83,4.67 D6.C
MODE_LED  (via drill 0.3)
  Top 0.127: v7.24,13.92 7.24,14.73 6.73,15.24 R1.1
  Bottom 0.127: U1.38 8.71,3.1 7.62,4.19 7.62,12.66 7.79,12.83 7.79,13.37 v7.24,13.92
N$1
  Bottom 0.127: Y1.1 23.4,13.77 20.83,13.77 20.44,13.77 19.9,13.23 15.52,13.23 15.01,12.72 U1.9
N$2
  Bottom 0.127: Y1.2 22.79,11.85 22.79,12.57 21.86,13.49 20.55,13.49 20.02,12.95 16.09,12.95 15.71,12.57 U1.10
N$3  (via drill 0.35)
  Top 0.127: C3.2 9.24,17.91 8.38,17.91 8,18.29 8,19.56 7.75,19.81 | Y4.P$4 4.45,19.81 7.75,19.81 | U$28.27 12.37,16.71 12.37,16.88 16.32,20.82 17.8,20.82 18.08,21.11 v19.3,21.11 | v17.79,24.01 13.09,24.01 v12.45,23.37 | v7.75,21.59 7.75,19.81
  Bottom 0.127: v19.3,21.11 17.79,22.62 v17.79,24.01 | v12.45,23.37 9.53,23.37 v7.75,21.59
N$4
  Top 0.127: R7.2 17.7,10.41 SW1.P2
N$5
  Top 0.127: D1.A R1.2
N$6
  Top 0.127: D2.A R2.2
N$9
  Top 0.127: U$28.26 12.71,15.89 12.7,15.88 12.32,15.88 12.1,16.09 10.03,16.09 C4.2 9.37,16.76 8.26,16.76 8.19,16.83 8.19,17.38 7.86,17.71 7.3,17.71 6.68,18.34 Y4.P$1
N$10
  Top 0.127: C6.2 12.71,12.81 U$28.9
N$12
  Top 0.127: U2.53 13.43,45.23 LED.A
N$15
  Top 0.127: U3.37 11.43,30.11 U2.24
N$16
  Top 0.127: R17.1 22.61,35.48 CHRG1.C
N$18
  Top 0.127: R30.2 11.19,45.72 LED.C
N$19  (via drill 0.35)
  Top 0.127: PROGRAM.P$2 20.42,35.33 v21.21,34.54 | v21.21,27.3 20.94,27.04 U3.20
  Bottom 0.127: v21.21,34.54 v21.21,27.3
N$22
  Top 0.127: U3.18 C14.1
N$25  (via drill 0.3)
  Top 0.254: U5.1 24.19,43.49 23.56,42.87 22.86,42.29 22.29,42.29 v22.23,42.35 | R17.2 23.57,35.22 v22.99,34.64 25.11,34.64 25.48,35 R18.2
  Bottom 0.254: v22.23,42.35 22.23,35.4 v22.99,34.64
N$26
  Top 0.254: U5.5 24.19,40.12 R19.1
N$27
  Top 0.127: U2.32 17.64,32.4 18.98,31.06 Y2.3
N$28
  Top 0.127: U2.33 17.82,33.91 21.8,33.91 Y2.1
N$29
  Top 0.127: U2.19 8.93,31.87 Y3.P$2
N$30
  Top 0.127: U2.20 9.43,31.4 9.39,31.36 9.39,28.62 Y3.P$1
N$31
  Top 0.127: R18.1 25.4,36.27 DONE1.A
N$33
  Top 0.254: C8.1 24.39,44.89 D4.C 25.15,43.53 24.96,42.97 24.39,42.97 U5.4 22.29,40.11 R20.2 22.4,38.98 CHRG1.A
N$35
  Top 0.254: R20.1 24,39.32 CHRG_INDC1.A
NRESET_3V
  Top 0.127: R13.1 13.71,12.5 U$28.11
PS0_3V
  Top 0.127: R5.1 10.07,13.42 U$28.6
PS1_3V
  Top 0.127: R6.1 U$28.5
RESET_B  (via drill 0.35)
  Top 0.127: U2.34 16.69,34.85 16.51,34.67 16.51,33.78 v17.14,33.15 | v17.14,23.37 16.13,23.37 15.61,22.85 U3.8
  Bottom 0.127: v17.14,33.15 v17.14,23.37
RXD_3V  (via drill 0.3)
  Top 0.127: v17.14,3.59 15.02,3.59 v14.99,3.56
  Bottom 0.127: R4.1 17.55,2.19 17.55,3.17 17.14,3.58 v17.14,3.59 | v14.99,3.56 14.99,2.18 U1.29
SCL  (via drill 0.3, 0.35)
  Top 0.127: U2.37 16.73,36.35 16.5,36.12 15.72,36.12 v15.67,36.07 | R10.1 9.73,15.24 9.23,14.73 8.51,14.73 7.62,15.37 v7.62,17.14 | v18.92,16.51 18.54,16.13 16.17,16.13 U$28.19
  Bottom 0.127: v15.67,36.07 15.67,21.9 14.67,20.89 | 14.67,20.89 13.99,20.22 13.99,17.75 14.61,17.14 15.54,17.14 15.75,16.93 16.23,16.93 16.44,17.14 18.29,17.14 v18.92,16.51 | 14.67,20.89 8.45,20.89 7.99,20.43 7.99,17.88 8,17.87 8,17.53 v7.62,17.14
SDA  (via drill 0.3)
  Top 0.127: U2.38 16.4,36.85 v16.26,36.7 | v15.99,17.5 16.05,17.44 | 16.05,17.44 16.85,16.64 R9.1 | U$28.20 16.05,16.88 16.05,17.44
  Bottom 0.127: v16.26,36.7 16.26,20.48 16,20.22 16,17.51 v15.99,17.5
SWD_CLK  (via drill 0.3)
  Top 0.127: U3.32 14.11,29.22 v14.1,29.21 | v14.1,34.29 10.54,34.29 10.35,34.1 10.35,33.42 10.41,33.36 10.41,33.15 10.43,33.13 U2.22
  Bottom 0.127: v14.1,29.21 v14.1,34.29
SWD_DIO  (via drill 0.3)  (1 unrouted)
  Top 0.127: U3.33 13.61,29.58 v13.24,29.21 | v13.21,33.72 12.13,33.72 11.93,33.52 U2.25
  Bottom 0.127: v13.24,29.21 13.24,33.69 v13.21,33.72
USB_CON_N
  Top 0.127: RN1.1 6.62,47.29 J1.2
USB_CON_P
  Top 0.127: RN1.2 5.97,46.94 J1.3
USB_D_N
  Top 0.127: RN1.4 7.1,39.62 6.84,39.35 U2.6
USB_D_P
  Top 0.127: RN1.3 6.76,44.75 6.76,40.12 6.49,39.85 U2.5
USB_SHIELD
  Top 0.406: J1.S4 3.73,49.66 8,49.66 8.96,48.69 J1.S3 10.04,47.82 L2.2
  Top 0.61: J1.S4 2.22,49.24 J1.S2 | J1.S3 9.72,49.24 J1.S1
VBAT
  Top 0.254: BATT_IN1.2 20.89,43.84 U5.3
VDDA
  Top 0.127: C17.1 3.77,31.95 3.77,33.86 3.94,34.03 R16.1 3.17,35.23 | 3.17,35.23 3.17,35.81 3.25,35.89 5.12,35.89 5.16,35.85 U2.13 | L3.1 4.06,42.55 3.09,43.51 1.61,43.51 1.21,43.1 1.21,37.2 3.17,35.23
VREF_OUT
  Top 0.127: C16.1 7.35,32.4 U2.17
VREFH
  Top 0.127: U2.14 4.88,35.35 C11.1 4.81,35.38 R16.2
VREFL
  Top 0.127: C17.2 6.26,32.07 C16.2 5.39,32.26 4.73,32.92 | L4.2 4.73,32.92 | C11.2 4.73,34.35 | 4.73,34.35 4.73,32.92 | 4.73,34.35 U2.16 U2.15
VUSB
  Top 0.254: D4.A 26.29,47.44 26.29,24.64 25.27,23.62 23.11,23.62 19.67,20.18 BATT_IN2.1

### Text on the board
tOrigins: ALPHA LINE | MOD # | OCTAL_CORE v0.1